# Altium schematic sheet 07-POWER.SchDoc
size A4; DocumentNumber: 7; SheetNumber: 7; SheetTotal: 8
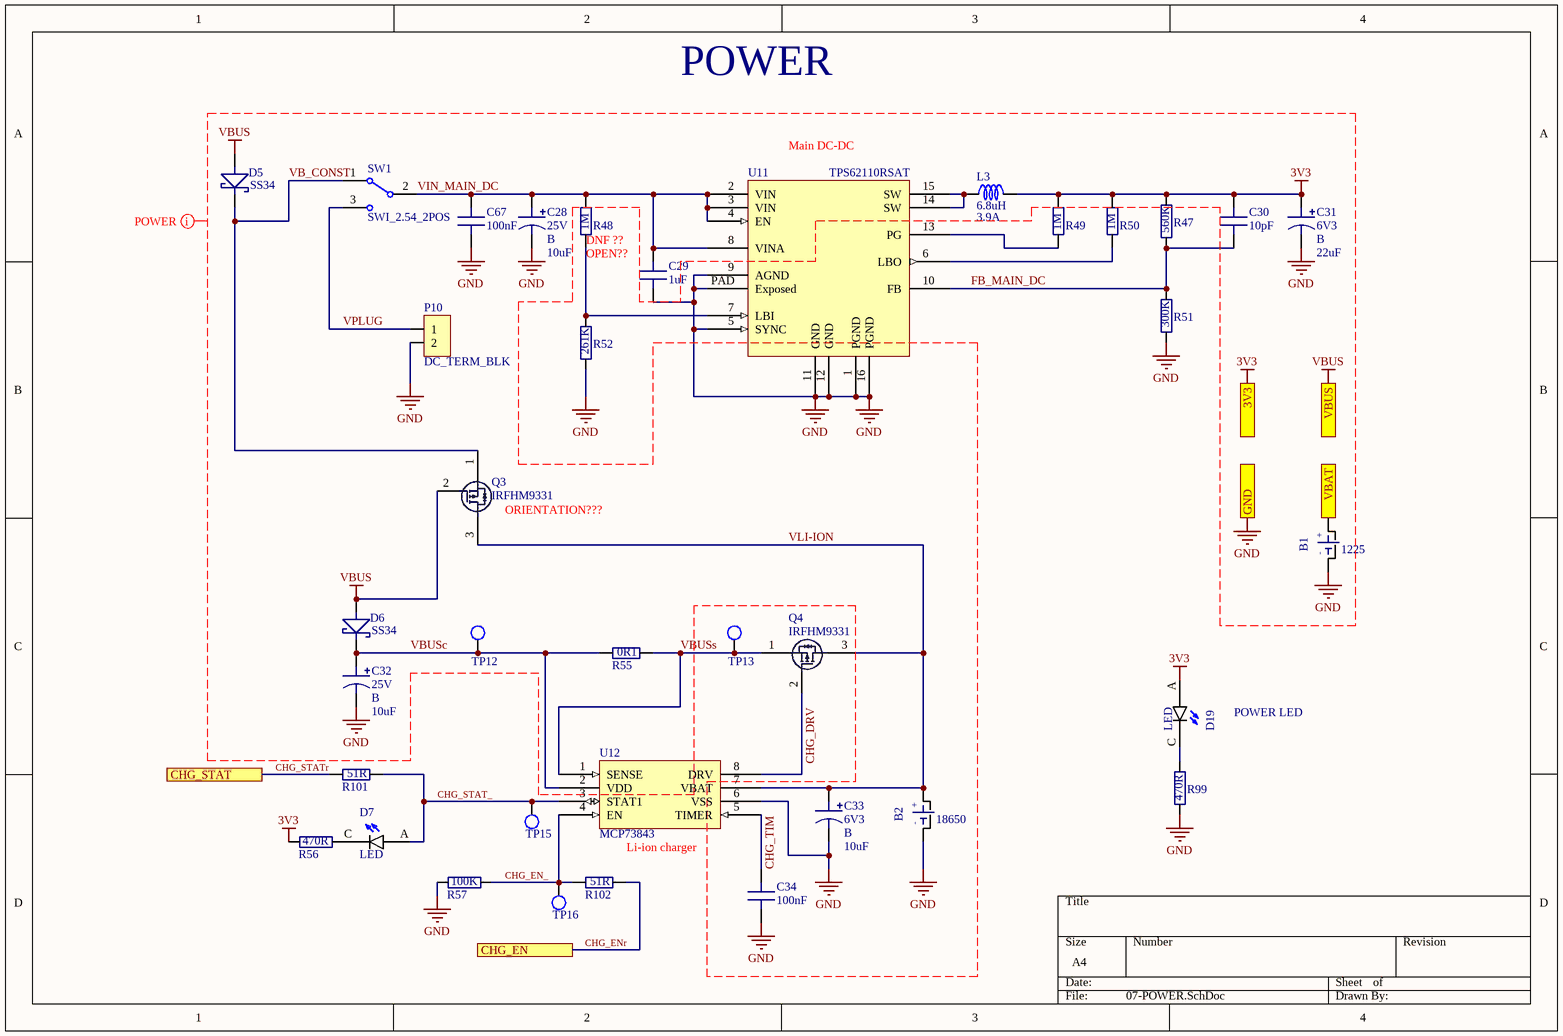
[diagram p0: 07-POWER.SchDoc]

## Parts
B1  Size: 1225  [BH500-CR1216/20/25-COMB]  (hidden comment: CR12XX_BH500)
B2  Size: 18650  [18650-COMBI]  (hidden comment: 18650_KEYS1042_HOLDER)
C28  Voltage: 25V  Size: B  [CAP_SIZE_B]  (hidden comment: 10uF)
C29  1uF  [C0805]
C30  10pF  [C0603]
C31  Voltage: 6V3  Size: B  [CAP_SIZE_B]  (hidden comment: 22uF)
C32  Voltage: 25V  Size: B  [CAP_SIZE_B]  (hidden comment: 10uF)
C33  Voltage: 6V3  Size: B  [CAP_SIZE_B]  (hidden comment: 10uF)
C34  100nF  [C0805]
C67  100nF  [C0805]
D5  Name: SS34  [DO-214AC]  (hidden comment: SMD-DIODE-SCHOTTKY-40V-3A(DO-214AB))
D6  Name: SS34  [DO-214AC]  (hidden comment: SMD-DIODE-SCHOTTKY-40V-3A(DO-214AB))
D7  LED  [LED_0604]
D19  LED  [LED_0604]
L3  Current: 3.9A  Inductivity: 6.8uH  [L_CDRH8D43]  (hidden comment: *)
P10  DC_TERM_BLK  [TERM_BLK_2.54]
Q3  IRFHM9331  [PQFN-3x3]
Q4  IRFHM9331  [PQFN-3x3]
R47  Resistance: 560K  [R0805]
R48  Resistance: 1M  [R0805]
R49  Resistance: 1M  [R0805]
R50  Resistance: 1M  [R0805]
R51  Resistance: 300K  [R0805]
R52  Resistance: 261K  [R0805]
R55  Resistance: 0R1  [R2512]
R56  Resistance: 470R  [R0603]
R57  Resistance: 100K  [R0603]
R99  Resistance: 470R  [R0603]
R101  Resistance: 51R  [R0402]
R102  Resistance: 51R  [R0402]
SW1  SWI_2.54_2POS  [SW_1x3 2.54]
TP12  TEST_POINT  [TP_1mm]  (value not drawn)
TP13  TEST_POINT  [TP_1mm]  (value not drawn)
TP15  TEST_POINT  [TP_1mm]  (value not drawn)
TP16  TEST_POINT  [TP_1mm]  (value not drawn)
U11  TPS62110RSAT  [VQFN-16]
U12  MCP73843  [MSOP-8-SOP65P490X110-8N]

## Ports
3V3 (out), CHG_EN, CHG_STAT, GND, VBAT (out), VBUS (out)

## Nets
3V3: C30.1 C31.1 D19.A L3.2 R47.2 R49.2 R50.2 R56.1 ; port 3V3
GND: B1.NEG B2.NEG C28.2 C29.1 C31.2 C32.2 C33.2 C34.1 C67.1 P10.2 R51.1 R52.1 R57.1 R99.1 U11.1(PGND) U11.5(SYNC) U11.9(AGND) U11.11(GND) U11.12(GND) U11.16(PGND) U11.PAD(Exposed) U12.6(VSS) ; port GND
VBUS: D5.A(POS) D6.A(POS) Q3.2(G) ; port VBUS
CHG_DRV: Q4.2(G) U12.8(DRV)
CHG_EN_: R57.2 R102.1 TP16.1 U12.4(EN)
CHG_ENr: R102.2 ; port CHG_EN
CHG_STAT_: D7.A R101.2 TP15.1 U12.3(STAT1)
CHG_STATr: R101.1 ; port CHG_STAT
CHG_TIM: C34.2 U12.5(TIMER)
FB_MAIN_DC: C30.2 R47.1 R51.2 U11.10(FB)
VB_CONST: D5.C(NEG) Q3.1(S) SW1.1
VBAT: B1.POS ; port VBAT
VBUSc: C32.1 D6.C(NEG) R55.1 TP12.1 U12.2(VDD)
VBUSs: Q4.1(S) R55.2 TP13.1 U12.1(SENSE)
VIN_MAIN_DC: C28.1 C29.2 C67.2 R48.2 SW1.2 U11.2(VIN) U11.3(VIN) U11.4(EN) U11.8(VINA)
VLI-ION: B2.POS C33.1 Q3.3(D) Q4.3(D) U12.7(VBAT)
VPLUG: P10.1 SW1.3
NetD7_C: D7.C R56.2
NetD19_C: D19.C R99.2
NetL3_1: L3.1 U11.14(SW) U11.15(SW)
NetR48_1: R48.1 R52.2 U11.7(LBI)
NetR49_1: R49.1 U11.13(PG)
NetR50_1: R50.1 U11.6(LBO)

## Layout directives
net class POWER_NET_CLASS: 3V3, CHG_TIM, GND, VB_CONST, VBUS, VBUSc, VBUSs, VIN_MAIN_DC, VLI-ION, VPLUG

## Notes on the sheet
- POWER
- (near U11) Main DC-DC
- (near R48) DNF ??
- (near R48) OPEN??
- (near Q3) ORIENTATION???
- POWER LED
- Li-ion charger
- (in symbol 18650_KEYS1042_HOLDER) +; -
- (in symbol CR12XX_BH500) +; -

## Library data of the parts
B1 = CR12XX_BH500: Coin Cell Battery 3V 12 X 2.5 mm 48mA Holder; MP: BR1225; MF: Panasonic Battery; Availability: Unavailable; Price: None; SnapEDA_Link: https://www.snapeda.com/parts/BR1225/Panasonic/view-part/?ref=snap; Package: Panasonic Battery; ComponentLink1Description: Kosmodrom; ComponentLink1URL: http://www.kosmodrom.com.ua/el.php?name=BH500; PriceKosmodromUAH: 8,25
B2 = 18650_KEYS1042_HOLDER: 18650 Li-ion Battery Holder; Price: None; ComponentLink1Description: Kosmodrom; ComponentLink1URL: http://www.kosmodrom.com.ua/el.php?name=KEYS1042; PriceKosmodromUAH: 19,5
C28 C32 = CAP_B_10uF_25V: Tantalum capacitor; Capacity: 10uF; Value: 10uF
C29 = C0805_1uF_25V: Ceramic capacitor; Voltage: 25V; Capacity: 1uF; Size: 0805; Value: 1uF
C30 = C0603_10pF_25V: Ceramic capacitor; Voltage: 25V; Capacity: 10pF; Size: 0603; Value: 10pF
C31 = CAP_B_22uF_6V3: Tantalum capacitor; Capacity: 22uF; Value: 22uF
C33 = CAP_B_10uF_6V3: Tantalum capacitor; Capacity: 10uF; Value: 10uF
C34 C67 = C0805_100nF_25V: Ceramic capacitor; Voltage: 25V; Capacity: 100nF; Size: 0805; Value: 100nF
D5 D6 = D_SS-34: Rectifier, Schottky; DO-214AB; 3.0A IF; 0.75V; 40V; 100A IFRM; 10000V/us; 1000pF; MF: Vishay; MP: SS34-E3/57T; Package: DO-214 Vishay; Price: 0.33 USD; SnapEDA_Link: https://www.snapeda.com/symbols-footprints/SS34-E3/57T/Vishay%20Semiconductor%20Diodes%20Division/view-part/?ref=snap; Availability: Good; Value: *
D7 D19 = LED: Led General; MF: Dialight; MP: 598-8140-107F; SnapEDA_Link: https://www.snapeda.com/parts/598-8140-107F/Dialight/view-part/?ref=snap; Price: None; Availability: Unavailable; Package: 0805 Dialight; Value: *
L3 = L_CDHR8D43_6.8uH_3.9A: Inductor Generic; Value: *; Size: CHDR8D43; Url: http://www.kosmodrom.com.ua/el.php?name=CDRH8D43NP-6R8NC
R47 = R0805_560K_1%: Resistor General; Tolerance: 1%; Size: 0805
R48-R50 = R0805_1M_1%: Resistor General; Tolerance: 1%; Size: 0805
R51 = R0805_300K_1%: Resistor General; Tolerance: 1%; Size: 0805
R52 = R0805_261K_1%: Resistor General; Tolerance: 1%; Size: 0805
R55 = R2512_0R1_1%: Resistor General; Tolerance: *; Size: 2512
R56 R99 = R0603_470R: Resistor General; Tolerance: 5%; Size: 0603
R57 = R0603_100K: Resistor General; Tolerance: 5%; Size: 0603
R101 R102 = R0402_51R: Resistor General; Tolerance: *; Size: 0402
SW1 = SWI_2.54_2POS: Generich 2 pos switch
U11 = TPS62110RSAT: TPS6211x 17-V, 1.5-A, Synchronous Step-Down Converter
U12 = MCP73843: MCP73843 Single Li-ion cell charger IC; MF: Microchip; Availability: Unavailable; MP: MCP73843; Price: None; Package: SOIC-8 ON Semiconductor; Value: *